# Altium schematic sheet Clock.SchDoc
size 420 x 297 mm
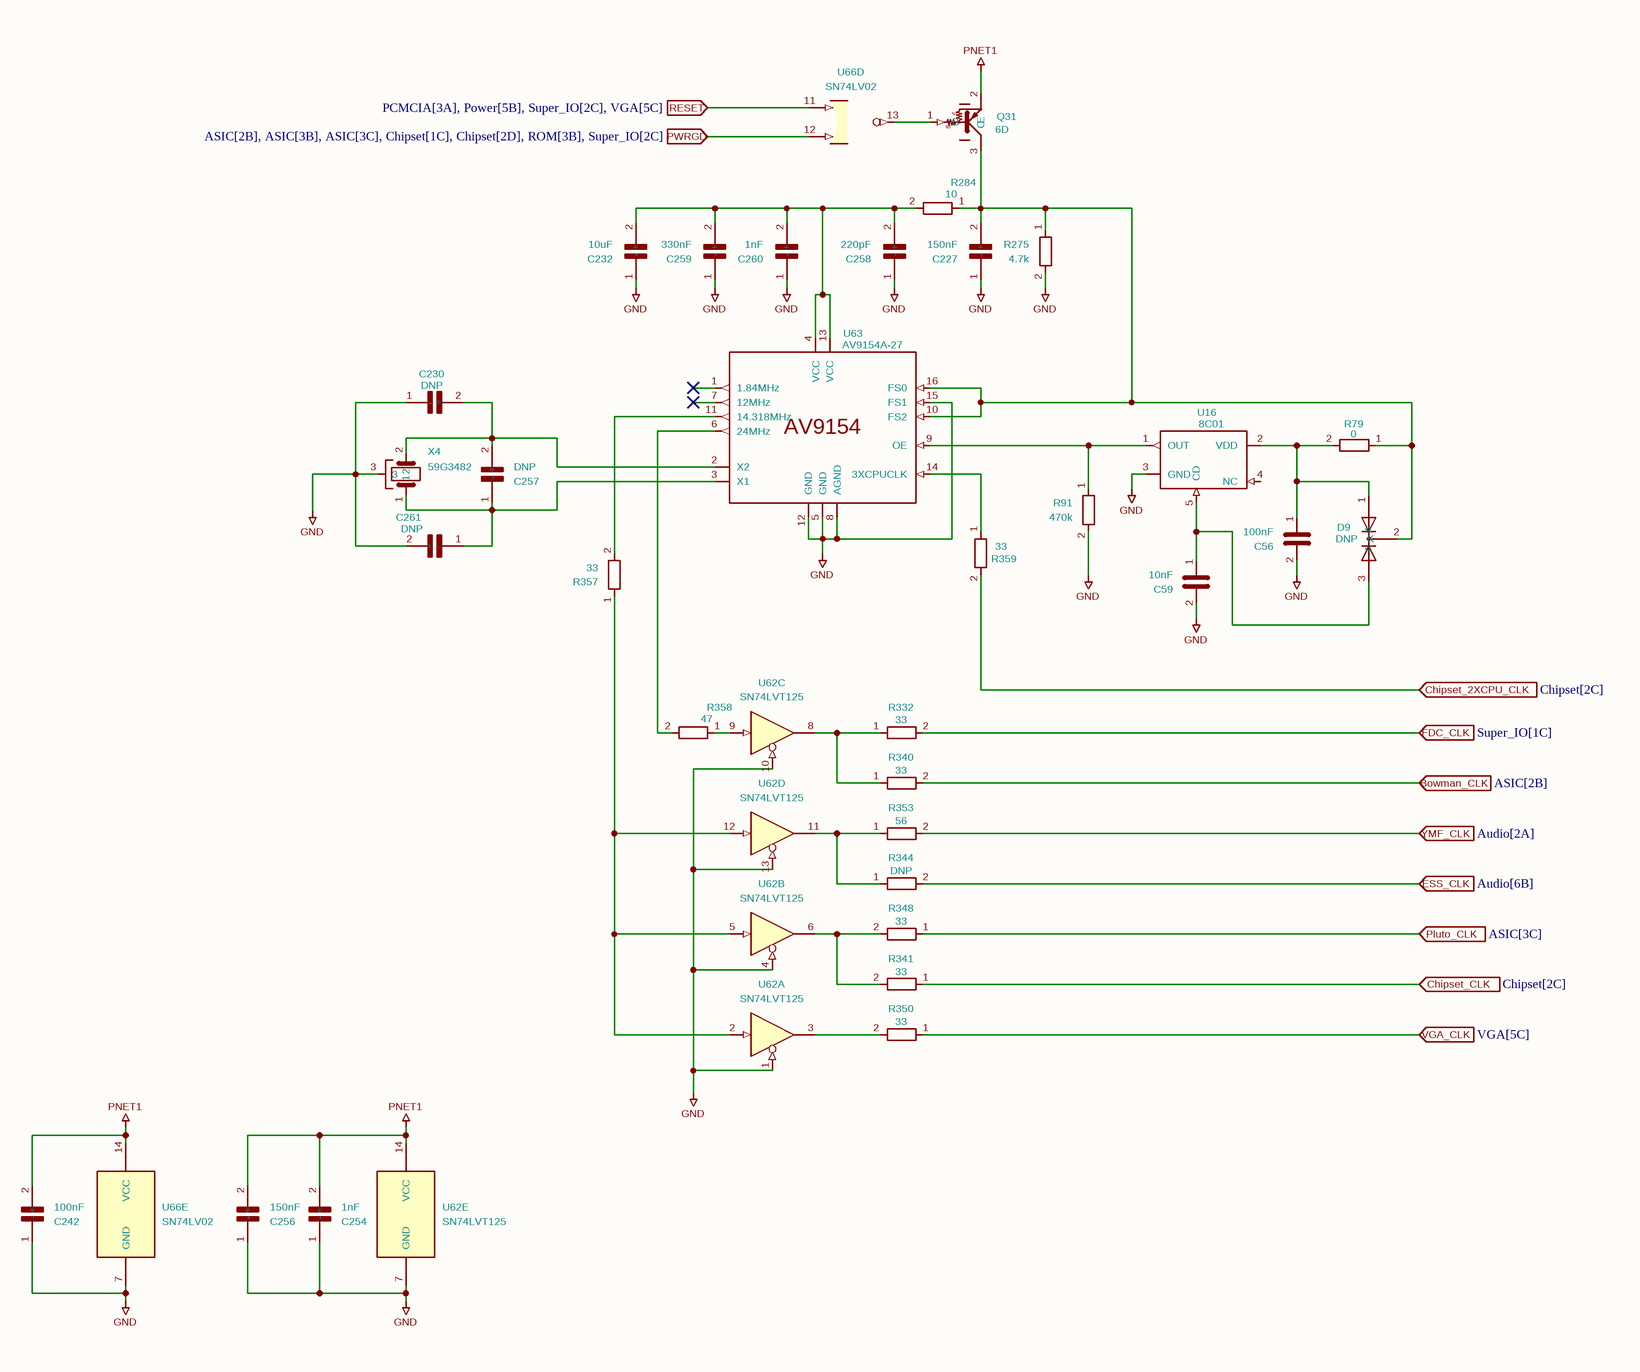
[diagram p0: Clock.SchDoc]

## Parts
C56  100nF  [C_0402_1005Metric]
C59  10nF  [C_0603_1608Metric]
C227  150nF  [C_0402_1005Metric]
C230  DNP  [C_0402_1005Metric]
C232  10uF  [C_1206_3216Metric]
C242  100nF  [C_0402_1005Metric]
C254  1nF  [C_0402_1005Metric]
C256  150nF  [C_0402_1005Metric]
C257  DNP  [C_0402_1005Metric]
C258  220pF  [C_0402_1005Metric]
C259  330nF  [C_0603_1608Metric]
C260  1nF  [C_0402_1005Metric]
C261  DNP  [C_0402_1005Metric]
D9  DNP  [3D]
Q31  6D  [SOT-23]
R79  0  [R_0402_1005Metric]
R91  470k  [R_0402_1005Metric]
R275  4.7k  [R_0402_1005Metric]
R284  10  [R_0805_2012Metric]
R332  33  [R_0402_1005Metric]
R340  33  [R_0402_1005Metric]
R341  33  [R_0402_1005Metric]
R344  DNP  [R_0402_1005Metric]
R348  33  [R_0402_1005Metric]
R350  33  [R_0402_1005Metric]
R353  56  [R_0402_1005Metric]
R357  33  [R_0402_1005Metric]
R358  47  [R_0402_1005Metric]
R359  33  [R_0402_1005Metric]
U16  8C01  [SOT-23-5]
U62  SN74LVT125  [TSSOP-14_4.4x5mm_P0.65mm]  (parts A,B,C,D,E of 5)
U63  AV9154A-27  [SOIC-16W]
U66  SN74LV02  [TSSOP-14_4.4x5mm_P0.65mm]  (parts D,E of 5)
X4  59G3482  [XTAL-6]

## Ports
Bowman_CLK (in, see ASIC[2B]), Chipset_2XCPU_CLK (in, see Chipset[2C]), Chipset_CLK (in, see Chipset[2C]), ESS_CLK (in, see Audio[6B]), FDC_CLK (in, see Super_IO[1C]), Pluto_CLK (in, see ASIC[3C]), PWRGD (in, see ASIC[2B], ASIC[3B], ASIC[3C], Chipset[1C], Chipset[2D], ROM[3B], Super_IO[2C]), RESET (in, see PCMCIA[3A], Power[5B], Super_IO[2C], VGA[5C]), VGA_CLK (in, see VGA[5C]), YMF_CLK (in, see Audio[2A])

## Nets
GND: C56.2 C59.2 C227.1(+) C230.1(+) C232.1(+) C242.1(+) C254.1(+) C256.1(+) C258.1(+) C259.1(+) C260.1(+) C261.2(-) R91.2 R275.2 U16.3(GND) U62.1 U62.4 U62.7(GND) U62.10 U62.13 U63.5(GND) U63.8(AGND) U63.12(GND) U63.15(FS1) U66.7(GND) X4.3
PNET1: C242.2(-) C254.2(-) C256.2(-) Q31.2(E) U62.14(VCC) U66.14(VCC)
Bowman_CLK: R340.2 ; port Bowman_CLK
Chipset_2XCPU_CLK: R359.2 ; port Chipset_2XCPU_CLK
Chipset_CLK: R341.1 ; port Chipset_CLK
ESS_CLK: R344.2 ; port ESS_CLK
FDC_CLK: R332.2 ; port FDC_CLK
Pluto_CLK: R348.1 ; port Pluto_CLK
PWRGD: U66.12 ; port PWRGD
RESET: U66.11 ; port RESET
VGA_CLK: R350.1 ; port VGA_CLK
YMF_CLK: R353.2 ; port YMF_CLK
NetC56_1: C56.1 D9.1(A) R79.2 U16.2(VDD)
NetC59_1: C59.1 D9.3(A) U16.5(CD)
NetC227_2: C227.2(-) D9.2(K) Q31.3(C) R79.1 R275.1 R284.1 U63.10(FS2) U63.16(FS0)
NetC230_2: C230.2(-) C257.2(-) U63.2(X2) X4.2
NetC232_2: C232.2(-) C258.2(-) C259.2(-) C260.2(-) R284.2 U63.4(VCC) U63.13(VCC)
NetC257_1: C257.1(+) C261.1(+) U63.3(X1) X4.1
NetQ31_1: Q31.1(B) U66.13
NetR91_1: R91.1 U16.1(OUT) U63.9(OE)
NetR332_1: R332.1 R340.1 U62.8
NetR341_2: R341.2 R348.2 U62.6
NetR344_1: R344.1 R353.1 U62.11
NetR350_2: R350.2 U62.3
NetR357_1: R357.1 U62.2 U62.5 U62.12
NetR357_2: R357.2 U63.11(14.318MHz)
NetR358_1: R358.1 U62.9
NetR358_2: R358.2 U63.6(24MHz)
NetR359_1: R359.1 U63.14(3XCPUCLK)

Not connected (* = marked no-connect by the designer): U16 4(NC); U63 1(1.84MHz)* 7(12MHz)*

## Notes on the sheet
- 1
- 2
- 3
- 4
- 5
- 6
- 7
- 8
- A
- B
- C
- D
- E
- Title: PC110
- File: Clock.kicad_sch
- Sheet: /
- Recreated by: Ahmad Byagowi
- F
- KiCad E.D.A.  kicad (5.1.4)-1
- Size: A3
- Date:
- Rev:
- Id: 1/1
- (in symbol DTA114Y) 47k; 10k

## Library data of the parts
C56 C59 C227 C230 C232 C242 C254 C256-C261 = C
  C56 C242: Value: 100nF; Footprint: Capacitor_SMD:C_0402_1005Metric
  C59: Value: 10nF; Footprint: Capacitor_SMD:C_0603_1608Metric
  C227 C256: Value: 150nF; Footprint: Capacitor_SMD:C_0402_1005Metric
  C230 C257 C261: Value: DNP; Footprint: Capacitor_SMD:C_0402_1005Metric
  C232: Value: 10uF; Footprint: Capacitor_SMD:C_1206_3216Metric
  C254 C260: Value: 1nF; Footprint: Capacitor_SMD:C_0402_1005Metric
  C258: Value: 220pF; Footprint: Capacitor_SMD:C_0402_1005Metric
  C259: Value: 330nF; Footprint: Capacitor_SMD:C_0603_1608Metric
D9 = D_Dual_CommonCathode_AKA: Value: DNP; Footprint: PC110:3D
Q31 = DTA114Y: Value: 6D; Footprint: PCM_Package_TO_SOT_SMD_AKL:SOT-23
R79 R91 R275 R284 R332 R340 R341 R344 R348 R350 R353 R357-R359 = R
  R79: Value: 0; Footprint: PCM_Resistor_SMD_AKL:R_0402_1005Metric
  R91: Value: 470k; Footprint: PCM_Resistor_SMD_AKL:R_0402_1005Metric
  R275: Value: 4.7k; Footprint: PCM_Resistor_SMD_AKL:R_0402_1005Metric
  R284: Value: 10; Footprint: PCM_Resistor_SMD_AKL:R_0805_2012Metric
  R332 R340 R341 R348 R350 R357 R359: Value: 33; Footprint: PCM_Resistor_SMD_AKL:R_0402_1005Metric
  R344: Value: DNP; Footprint: PCM_Resistor_SMD_AKL:R_0402_1005Metric
  R353: Value: 56; Footprint: PCM_Resistor_SMD_AKL:R_0402_1005Metric
  R358: Value: 47; Footprint: PCM_Resistor_SMD_AKL:R_0402_1005Metric
U16 = QC01: Value: 8C01; Footprint: Package_TO_SOT_SMD:SOT-23-5
U62 = 74LS125: Value: SN74LVT125; Footprint: Package_SO:TSSOP-14_4.4x5mm_P0.65mm
U63 = AV9154: Value: AV9154A-27; Footprint: PC110:SOIC-16W
U66 = 74LS02: Value: SN74LV02; Footprint: Package_SO:TSSOP-14_4.4x5mm_P0.65mm
X4 = Crystal_GND3: Value: 59G3482; Footprint: PC110:XTAL-6